# Altium schematic sheet Sheet1.SchDoc
size B
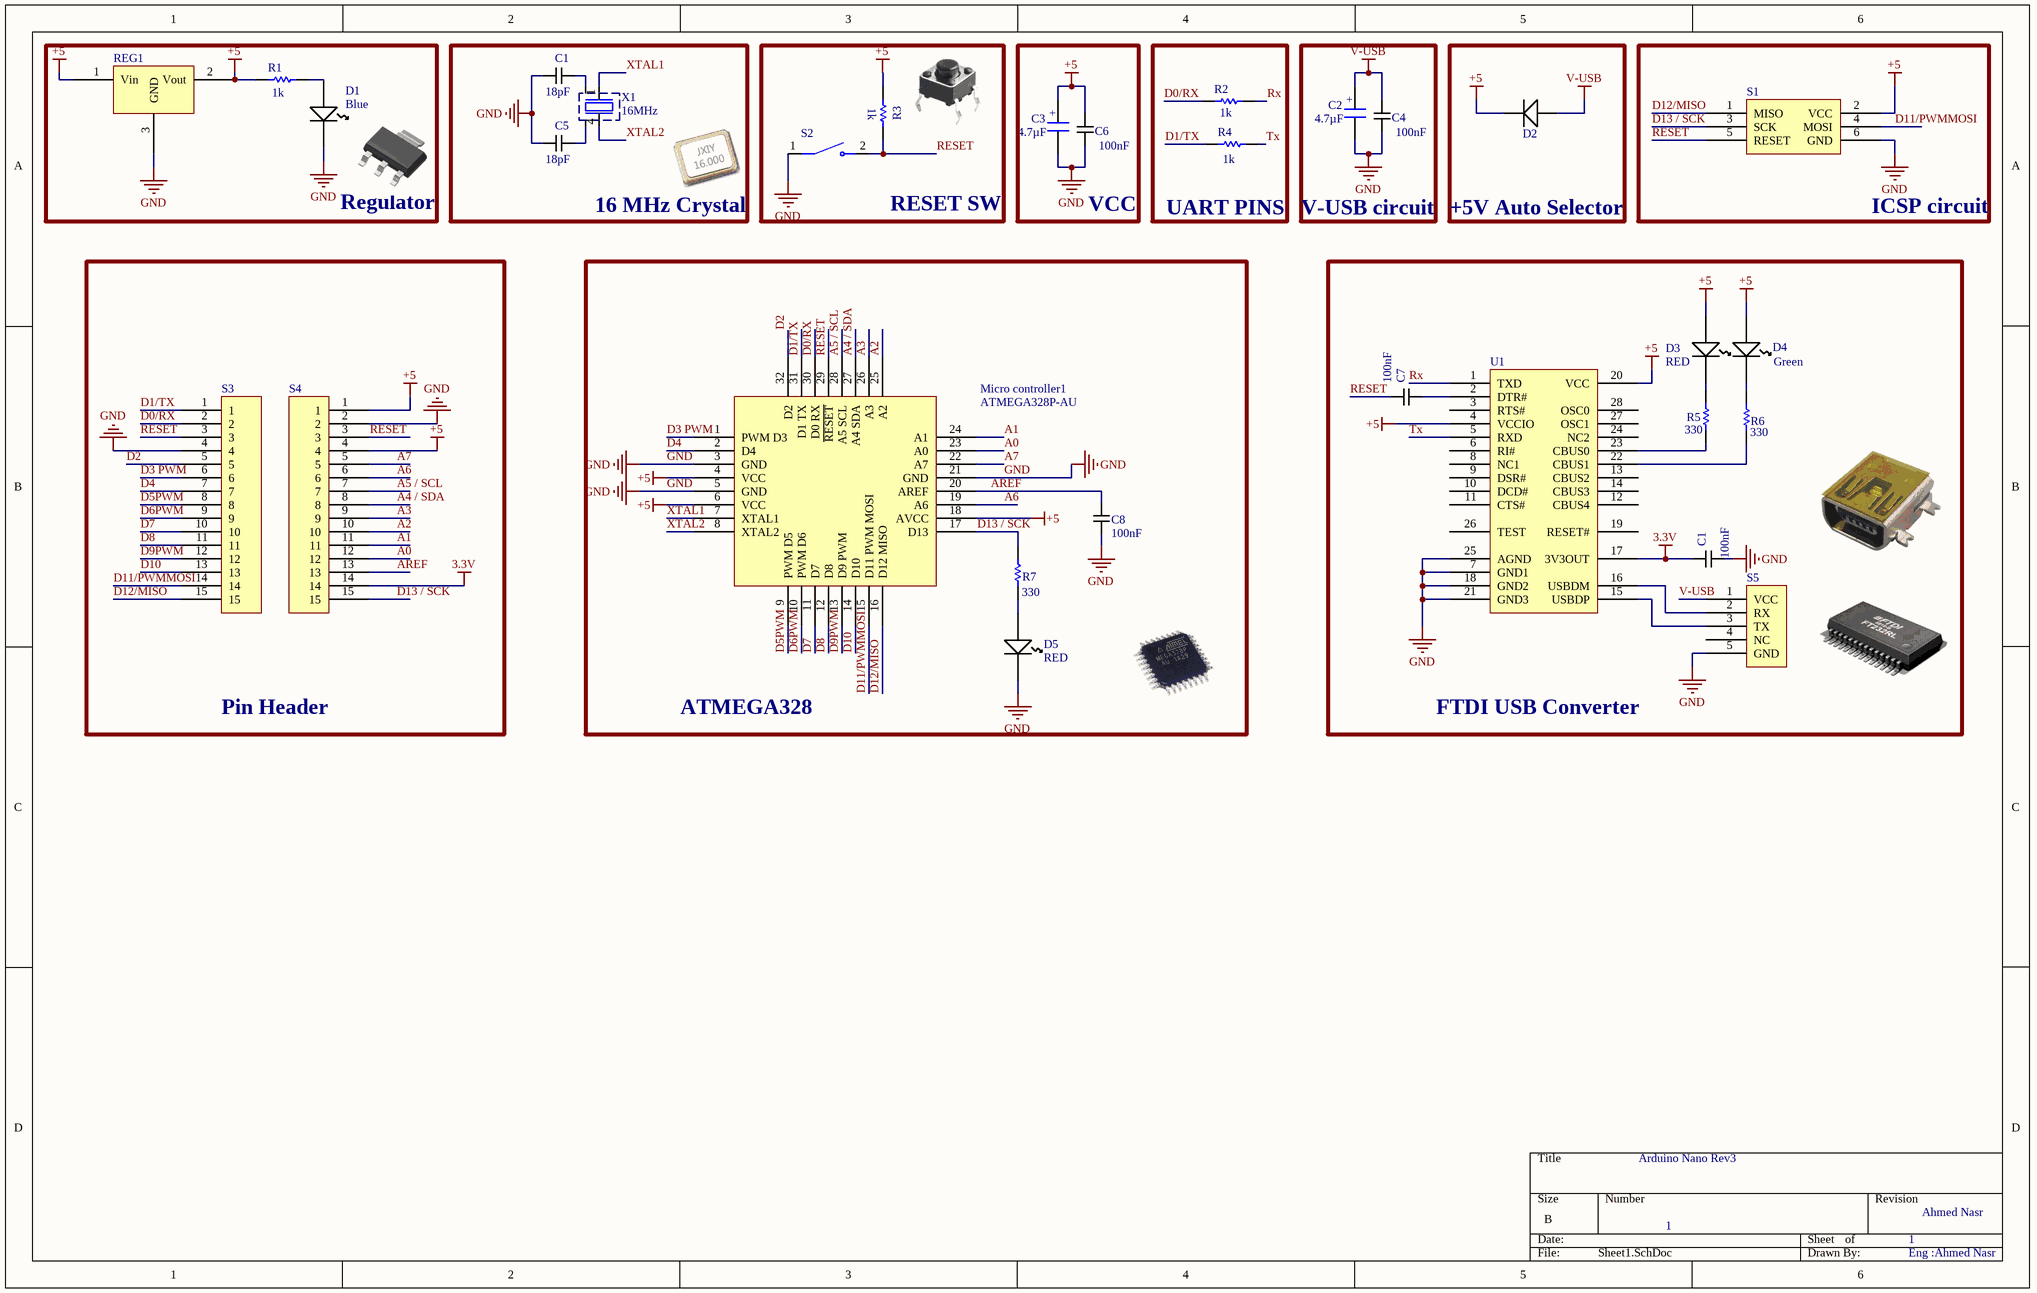
[diagram p0: Sheet1.SchDoc]

## Parts
(Parts that share a designator on the sheet are numbered #1, #2 ... from top to bottom, then left to right.)
C1#1  Capacitance: 18pF  [CAPCP2012X09N]  (hidden comment: C0805C180J5GACTU)
C1#2  Capacitance: 100nF  [CAPCP2012X09N]  (hidden comment: 100nF Ceramic Multilayer Capacitor_1)
C2  value 4.7µF  [CASE A - 3216X18]  (hidden comment: Capacitor SMT Tantalum)
C3  value 4.7µF  [CASE A - 3216X18]  (hidden comment: Capacitor SMT Tantalum)
C4  Capacitance: 100nF  [CAPCP2012X09N]  (hidden comment: 100nF Ceramic Multilayer Capacitor_1)
C5  Capacitance: 18pF  [CAPCP2012X09N]  (hidden comment: C0805C180J5GACTU)
C6  Capacitance: 100nF  [CAPCP2012X09N]  (hidden comment: 100nF Ceramic Multilayer Capacitor_1)
C7  Capacitance: 100nF  [CAPCP2012X09N]  (hidden comment: 100nF Ceramic Multilayer Capacitor_1)
C8  Capacitance: 100nF  [CAPCP2012X09N]  (hidden comment: 100nF Ceramic Multilayer Capacitor_1)
D1  Color: Blue  [LED1913X12NBLUE]  (hidden comment: Kingbright Blue LED, 60 mcd 120 ° 0805)
D2  Panasonic DB2J20900L Schottky Diode, 0.5A, 20V, 2.4ns, 2-Pin SMini2 F5 B  [DIOM1712X07N]  (value not drawn)
D3  Color: RED  [LED1913X12NRED]  (hidden comment: Kingbright Red LED, 100 mcd 120 ° 0805)
D4  Color: Green  [LED1913X12NGREEN]  (hidden comment: Kingbright Green LED, 70 mcd 120 ° 0805)
D5  Color: RED  [LED1913X12NRED]  (hidden comment: Kingbright Red LED, 100 mcd 120 ° 0805)
Micro_controller1  ATMEGA328P-AU  [TQFP80P900X900X120-32N]
R1  CRCW1206470RFKEA  [RESC3216X60X45ML10T20]  (value not drawn)
R2  CRCW1206470RFKEA  [RESC3216X60X45ML10T20]  (value not drawn)
R3  CRCW1206470RFKEA  [RESC3216X60X45ML10T20]  (value not drawn)
R4  CRCW1206470RFKEA  [RESC3216X60X45ML10T20]  (value not drawn)
R5  CRCW1206470RFKEA  [RESC3216X60X45ML10T20]  (value not drawn)
R6  CRCW1206470RFKEA  [RESC3216X60X45ML10T20]  (value not drawn)
R7  CRCW1206470RFKEA  [RESC3216X60X45ML10T20]  (value not drawn)
REG1  LM1117MP-5.0/NOPB, Low Dropout Voltage Regulator, 1.5A, 5 V ±1%, 4-Pin SOT-223  [SOT230P700X180-4N]  (value not drawn)
S1  Programming Headers Dual Row  [ISP HEADER]  (value not drawn)
S2  (no value)  [SW_TL1107BF130WQ]
S3  connector;str header;single row;.1 cont centers;.095 tail;gold or gtx;36 contact  [Header]  (value not drawn)
S4  connector;str header;single row;.1 cont centers;.095 tail;gold or gtx;36 contact  [Header]  (value not drawn)
S5  NewMolex Right Angle SMT Female Type B Micro USB Connector, 30 V ac, 1.8A  [MicroUSB]  (value not drawn)
U1  FT232RL, Universal Asynchronous Receiver & Transmitter 3MBd, 28-Pin, SSOP  [SOP65P780X200-28N]  (value not drawn)
X1  value 16MHz  [Aker S5C Crystal]  (hidden comment: Aker 16MHz Crystal SMT)

## Blocks framed on the sheet
Regulator: D1 R1 REG1
16 MHz Crystal: C1#1 C5 X1
RESET SW: R3 S2
VCC: C3 C6
UART PINS: R2 R4
V-USB circuit: C2 C4
+5V Auto Selector: D2
ICSP circuit: S1
Pin Header: S3 S4
ATMEGA328: C8 D5 Micro_controller1 R7
FTDI USB Converter: C1#2 C7 D3 D4 R5 R6 S5 U1

## Nets
3.3V: C1#2.1 S4.14 U1.17(3V3OUT)
+5: C3.1 C6.1 D2.1 D3.1(A) D4.1(A) Micro_controller1.4(VCC) Micro_controller1.6(VCC) Micro_controller1.18(AVCC) R1.1 R3.2 REG1.1(Vin) REG1.2(Vout) S1.2(VCC) S4.1 S4.4 U1.4(VCCIO) U1.20(VCC)
GND: C1#1.2 C1#2.2 C2.2 C3.2 C4.1 C5.1 C6.2 C8.2 D1.2(K) D5.2(K) Micro_controller1.3(GND) Micro_controller1.5(GND) Micro_controller1.21(GND) REG1.3(GND) S1.6(GND) S2.1 S3.4 S4.2 S5.5(GND) U1.7(GND1) U1.18(GND2) U1.21(GND3) U1.25(AGND)
V-USB: C2.1 C4.2 D2.2 S5.1(VCC)
A0: Micro_controller1.23(A0) S4.12
A1: Micro_controller1.24(A1) S4.11
A2: Micro_controller1.25(A2) S4.10
A3: Micro_controller1.26(A3) S4.9
A4 / SDA: Micro_controller1.27(A4_SDA) S4.8
A5 / SCL: Micro_controller1.28(A5_SCL) S4.7
A6: Micro_controller1.19(A6) S4.6
A7: Micro_controller1.22(A7) S4.5
AREF: C8.1 Micro_controller1.20(AREF) S4.13
D0/RX: Micro_controller1.30(D0_RX) R2.1 S3.2
D1/TX: Micro_controller1.31(D1_TX) R4.1 S3.1
D2: Micro_controller1.32(D2) S3.5
D3 PWM: Micro_controller1.1(PWM_D3) S3.6
D4: Micro_controller1.2(D4) S3.7
D5PWM: Micro_controller1.9(PWM_D5) S3.8
D6PWM: Micro_controller1.10(PWM_D6) S3.9
D7: Micro_controller1.11(D7) S3.10
D8: Micro_controller1.12(D8) S3.11
D9PWM: Micro_controller1.13(D9_PWM) S3.12
D10: Micro_controller1.14(D10) S3.13
D11/PWMMOSI: Micro_controller1.15(D11_PWM_MOSI) S1.4(MOSI) S3.14
D12/MISO: Micro_controller1.16(D12_MISO) S1.1(MISO) S3.15
D13 / SCK: Micro_controller1.17(D13) R7.2 S1.3(SCK) S4.15
RESET: C7.1 Micro_controller1.29(~{RESET}) R3.1 S1.5(RESET) S2.2 S3.3 S4.3
Rx: R2.2 U1.1(TXD)
Tx: R4.2 U1.5(RXD)
XTAL1: Micro_controller1.7(XTAL1) X1.1
XTAL2: Micro_controller1.8(XTAL2) X1.4
NetC1#1_1: C1#1.1 X1.3(Gnd)
NetC5_2: C5.2 X1.2(Gnd)
NetC7_2: C7.2 U1.2(DTR#)
NetD1_1: D1.1(A) R1.2
NetD3_2: D3.2(K) R5.1
NetD4_2: D4.2(K) R6.2
NetD5_1: D5.1(A) R7.1
NetR5_2: R5.2 U1.23(CBUS0)
NetR6_1: R6.1 U1.22(CBUS1)
NetS5_2: S5.2(RX) U1.16(USBDM)
NetS5_3: S5.3(TX) U1.15(USBDP)

Not connected (* = marked no-connect by the designer): S5 4(NC); U1 3(RTS#) 6(RI#) 8(NC1) 9(DSR#) 10(DCD#) 11(CTS#) 12(CBUS4) 13(CBUS2) 14(CBUS3) 19(RESET#) 24(NC2) 26(TEST) 27(OSC1) 28(OSC0)

## Notes on the sheet
- (near R1) 1k
- (near R3) 1k
- (near R2) 1k
- (near R4) 1k
- (near R5) 330
- (near R6) 330
- (near R7) 330
- Arduino Nano Rev3
- 1
- Ahmed Nasr
- Eng :Ahmed Nasr
- (in symbol 4.7µF Tant RS 496-3545) +

## Library data of the parts
C1#1 C5 = 18pF Ceramic Multilayer Capacitor, 50 V dc C0G Dielectric ±5% SMD: Manufacturer: Kemet; Voltage: 50V; Creator: Ritesh Kanjee; Date Created: 18 February 2015; Package: 0805; RS Stock No.: 648-0935; Datasheet URL: http://za.rs-online.com/web/p/ceramic-multilayer-capacitors/6480935/?searchTerm=C0805C180J5GACTU&relevancy-data=636F3D3226696E3D4931384E4B6E6F776E41734D504E266C753D656E266D6D3D6D61746368616C6C7061727469616C26706D3D5E5B5C707B4C7D5C707B4E647D2D2C2F255C2E5D2B2426706F3D313326736E3D592673743D4D414E5F504152545F4E554D4245522677633D424F5448267573743D4330383035433138304A35474143545526
C1#2 C4 C6-C8 = 100nF Ceramic Multilayer Capacitor_1: AVX 0805 Standard 100nF Ceramic Multilayer Capacitor, 50 V dc X7R Dielectric ±10% SMD; Voltage: 50V; Creator: Ritesh Kanjee; Date Created: 18 February 2015; Package: 0805; Manufacturer: AVX; RS Stock No.: 464-6688; Datasheet URL: http://za.rs-online.com/web/p/ceramic-multilayer-capacitors/4646688/
C2 C3 = 4.7µF Tant RS 496-3545: Capacitor,tantalum,SMT,16V,4.7uF,10%,A-case; Part Originator: H Theron; RS Stock Nr.: 496-3545; Tolerance: 10%; Package: 3216-18; Publisher: DPSS; LatestRevisionDate: 28-April-2010; ComponentLink1Description: Supplier Website; ComponentLink1URL: http://za.rs-online.com/web/search/searchBrowseAction.html?method=getProduct&R=4963545; ComponentLink2Description: RS Data sheet; ComponentLink2URL: http://docs-europe.origin.electrocomponents.com/webdocs/04ed/0900766b804ed4cc.pdf; Voltage: 16V
D1 = Kingbright Blue LED, 60 mcd 120 ° 0805: Manufacturer Part No.: KP-2012PBC-A; Forward Voltage: 3.2V; Creator: Ritesh Kanjee; Date Created: 18 February 2015; Manufacturer: KingBright; RS Stock No.: 466-3784; Datasheet URL: http://za.rs-online.com/web/p/visible-leds/4663784/
D2 = Schottky Diode, 0.5A, 20V, 2.4ns, 2-Pin SMini2 F5 B: Created By: R Kanjee; Date Created: 1 March 2015; Manufacturer: Panasonic; RS Stock No.: 713-2703; Manufacturer Part No.: DB2J20900L; Datasheet: http://docs-europe.electrocomponents.com/webdocs/1398/0900766b813986b3.pdf; Maximum Continuous Forward Current: 0.5A; Peak Reverse Repetitive Voltage: 20V
D3 D5 = Kingbright Red LED, 100 mcd 120 ° 0805: Manufacturer Part No.: KP-2012SRC-PRV; Forward Voltage: 1.85V; Creator: Ritesh Kanjee; Date Created: 18 February 2015; Manufacturer: KingBright; RS Stock No.: 466-3813; Datasheet URL: http://za.rs-online.com/web/p/visible-leds/4663813/
D4 = Kingbright Green LED, 70 mcd 120 ° 0805: Manufacturer Part No.: KP-2012MGC; Forward Voltage: 2.1 V; Creator: Ritesh Kanjee; Date Created: 18 February 2015; Manufacturer: KingBright; RS Stock No.: 466-3778; Datasheet URL: http://za.rs-online.com/web/p/visible-leds/4663778/
Micro_controller1 = ATMEGA328P-AU: ATMEGA328P-AU, 8 bit AVR Microcontroller 20MHz 1 kB, 32 kB Flash, 2 kB RAM, I2C 32-Pin TQFP; Company: Lumina Inova; Created By: Ritesh Kanjee; Date Created: 14 February 2015; RS Stock No.: 696-3092; Datasheet URL: http://docs-europe.electrocomponents.com/webdocs/0db4/0900766b80db4deb.pdf
R1-R7 = CMP-2003-02206-1: Manufacturer: Vishay Dale; Part Number: CRCW1206470RFKEA
REG1 = LM1117MP-5.0: Manufacturer: Texas Instruments; Supply Current: 1.5Amps; Output Voltage: 5V; Maximum Input Voltage: 15V; Date Created: 26 February 2015; Created By: R Kanjee; RS Stock No.: 533-9583; Datasheet URL: http://za.rs-online.com/web/p/low-dropout-voltage-regulators/5339583/
S1 = Programming ISP, Programming Headers Dual Row: Manufacturer: FCI; Manufacturer Part No.: 68000-236HLF; Current Rating: 3Amps Continuous; Created By: R Kanjee; Date Created: 1 March 2015; RS Stock No.: 2509565626
S2 = TL1107BF130WQ: SWITCH TACTILE SPST-NO 0.05A 12V; MF: E-Switch; Check_prices: https://www.snapeda.com/parts/TL1107BF130WQ/E-Switch/view-part/?ref=eda; SnapEDA_Link: https://www.snapeda.com/parts/TL1107BF130WQ/E-Switch/view-part/?ref=snap; Availability: In Stock; Purchase-URL: https://pricing.snapeda.com/search/part/TL1107BF130WQ/?ref=eda; Value: *; Price: None; MP: TL1107BF130WQ; Package: None
S3 S4 = Single row; PCB headers: Manufacturer: FCI; Manufacturer Part No.: 68000-236HLF; Current Rating: 3Amps Continuous; Created By: R Kanjee; Date Created: 1 March 2015; RS Stock No.: 2509565626
S5 = Micro USB Connector, 30 V ac, 1.8A: Manufacturer: Molex; Manufacturer Part No.: 105017-0001; Max Voltage: 30V; Creator: R Kanjee; Date Created: 28 February 2015; Datasheet URL: http://za.rs-online.com/web/p/micro-usb-connectors/8486764/; Max Current: 1.8A; RS Stock No: 848-6764
U1 = FT232RL USB to UART, Universal Asynchronous Receiver & Transmitter 3MBd, 28-Pin, SSOP: Manufacturer: FTDI Chip; Creator: R Kanjee; Date Created: 03 March 2015; Manufacturer Part No.: FT232RL; RS Stock No.: 406-580; Pin Count: 28
X1 = Aker  C5S-16.000-12-3030-X: Aker S5C SMT Crystal; Load Capacitance: 12pF; Frequency Stability: +/-30ppm; RS: RS 671-9488; Creator: R Kanjee; Manufacturer: Aker; Manufacturer Part #: C5S-16.000-12-3030-X; Supplier: RS; RS Stock Nr.: 671-9488; HelpURL: http://za.rs-online.com/web/p/crystal-units/6719488/; Package: 3.2x5mm SMD